# EAGLE schematic thermokipio (EAGLE 7.1.0)

## Sheet 1 of 2
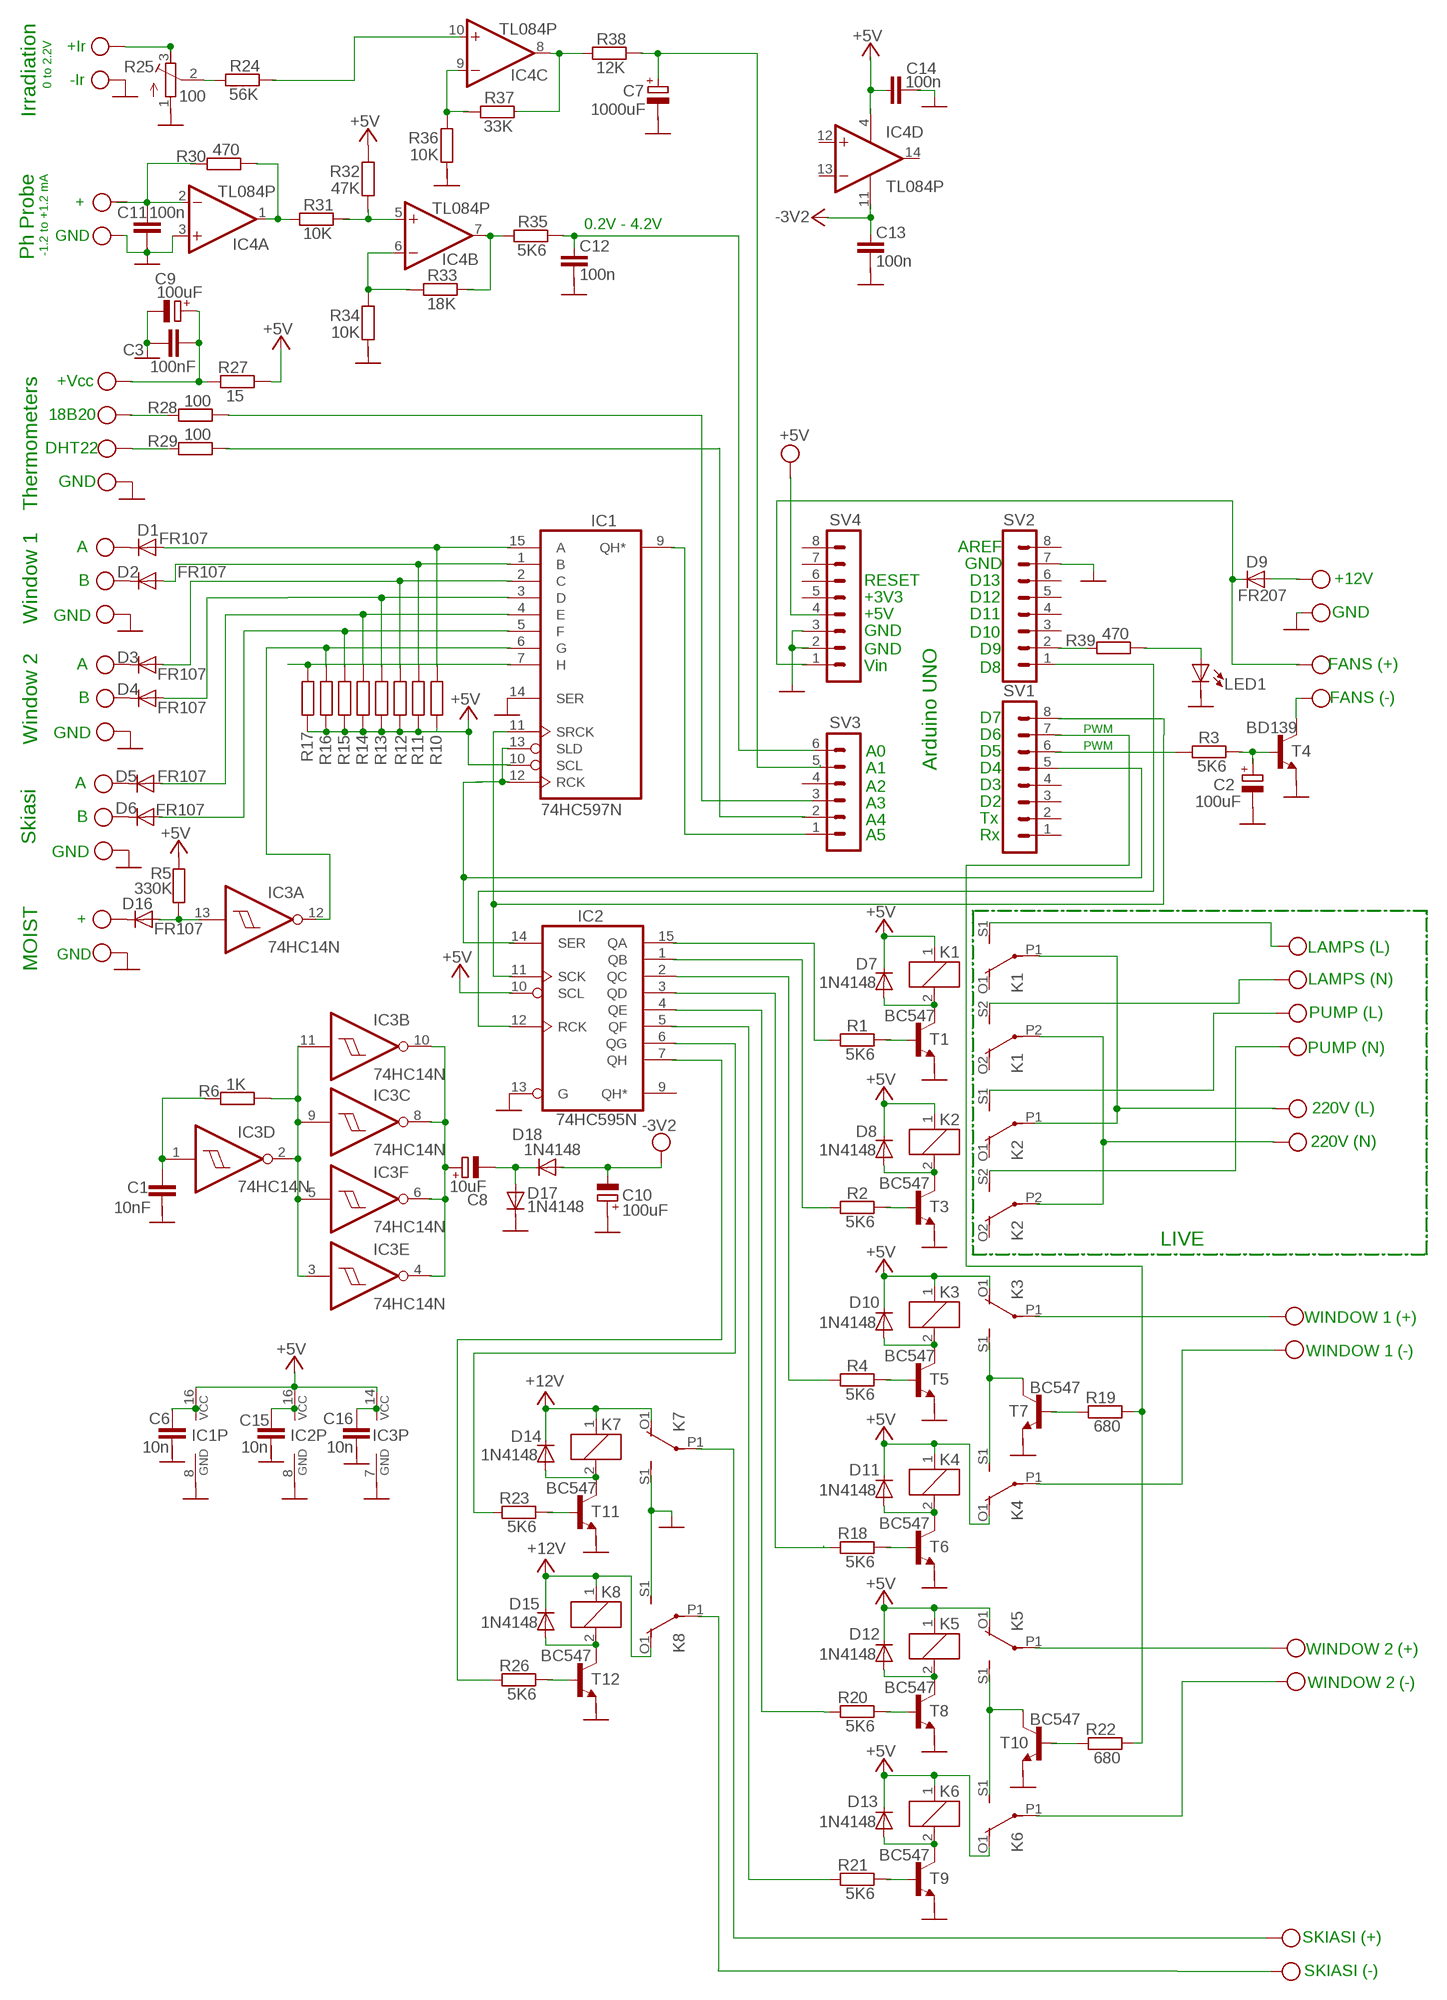
[diagram p0: schematic, sheet 1]

### Parts
A  W237-103  [W237-103]
A1  W237-103  [W237-103]
A2  W237-103  [W237-103]
C1  10nF  C5/2.5  [C5B2.5]
C2  100uF  CPOL-EUE2-5  [E2-5]
C3  100nF  C5/2.5  [C5B2.5]
C6  10n  C5/2.5  [C5B2.5]
C7  1000uF  CPOL-EUE2-5  [E2-5]
C8  10uF  CPOL-EUE2-5  [E2-5]
C9  100uF  CPOL-EUE2-5  [E2-5]
C10  100uF  CPOL-EUE2-5  [E2-5]
C11  100n  C5/2.5  [C5B2.5]
C12  100n  C5/2.5  [C5B2.5]
C13  100n  C5/2.5  [C5B2.5]
C14  100n  C5/2.5  [C5B2.5]
C15  10n  C5/2.5  [C5B2.5]
C16  10n  C5/2.5  [C5B2.5]
D1  FR107  1N4148DO35-7  [DO35-7]
D2  FR107  1N4148DO35-7  [DO35-7]
D3  FR107  1N4148DO35-7  [DO35-7]
D4  FR107  1N4148DO35-7  [DO35-7]
D5  FR107  1N4148DO35-7  [DO35-7]
D6  FR107  1N4148DO35-7  [DO35-7]
D7  1N4148  1N4148DO35-7  [DO35-7]
D8  1N4148  1N4148DO35-7  [DO35-7]
D9  FR207  1N4148DO35-7  [DO35-7]
D10  1N4148  1N4148DO35-7  [DO35-7]
D11  1N4148  1N4148DO35-7  [DO35-7]
D12  1N4148  1N4148DO35-7  [DO35-7]
D13  1N4148  1N4148DO35-7  [DO35-7]
D14  1N4148  1N4148DO35-7  [DO35-7]
D15  1N4148  1N4148DO35-7  [DO35-7]
D16  FR107  1N4148DO35-7  [DO35-7]
D17  1N4148  1N4148DO35-7  [DO35-7]
D18  1N4148  1N4148DO35-7  [DO35-7]
DHT  +3V3  W237-4  [W237-4]
DHT1  +3V3  W237-4  [W237-4]
IC1  74HC597N  [DIL16]
IC2  74HC595N  [DIL16]
IC3  74HC14N  [DIL14]
IC4  TL084P  [DIL14]
K1  4052  [F4052]
K2  4052  [F4052]
K3  4052  [F4052]
K4  4052  [F4052]
K5  4052  [F4052]
K6  4052  [F4052]
K7  4052  [F4052]
K8  4052  [F4052]
LED1  LEDCHIP-LED0603  [CHIP-LED0603]
R1  5K6  R0204/7  [0204/7]
R2  5K6  R0204/7  [0204/7]
R3  5K6  R0204/7  [0204/7]
R4  5K6  R0204/7  [0204/7]
R5  330K  R0204/7  [0204/7]
R6  1K  R0204/7  [0204/7]
R10  R0204/7  [0204/7]
R11  R0204/7  [0204/7]
R12  R0204/7  [0204/7]
R13  R0204/7  [0204/7]
R14  R0204/7  [0204/7]
R15  R0204/7  [0204/7]
R16  R0204/7  [0204/7]
R17  R0204/7  [0204/7]
R18  5K6  R0204/7  [0204/7]
R19  680  R0204/7  [0204/7]
R20  5K6  R0204/7  [0204/7]
R21  5K6  R0204/7  [0204/7]
R22  680  R0204/7  [0204/7]
R23  5K6  R0204/7  [0204/7]
R24  56K  R0204/7  [0204/7]
R25  100  R-TRIMM64Z  [RTRIM64Z]
R26  5K6  R0204/7  [0204/7]
R27  15  R0204/7  [0204/7]
R28  100  R0204/7  [0204/7]
R29  100  R0204/7  [0204/7]
R30  470  R0204/7  [0204/7]
R31  10K  R0204/7  [0204/7]
R32  47K  R0204/7  [0204/7]
R33  18K  R0204/7  [0204/7]
R34  10K  R0204/7  [0204/7]
R35  5K6  R0204/7  [0204/7]
R36  10K  R0204/7  [0204/7]
R37  33K  R0204/7  [0204/7]
R38  12K  R0204/7  [0204/7]
R39  470  R0204/7  [0204/7]
SV1  MA08-1  [MA08-1]
SV2  MA08-1  [MA08-1]
SV3  MA06-1  [MA06-1]
SV4  MA08-1  [MA08-1]
T1  BC547  [TO92]
T3  BC547  [TO92]
T4  BD139  BC547  [TO92]
T5  BC547  [TO92]
T6  BC547  [TO92]
T7  BC547  [TO92]
T8  BC547  [TO92]
T9  BC547  [TO92]
T10  BC547  [TO92]
T11  BC547  [TO92]
T12  BC547  [TO92]
X2  W237-102  [W237-102]
X3  W237-103  [W237-103]
X4  W237-103  [W237-103]
X5  W237-103  [W237-103]
X6  W237-103  [W237-103]
X7  W237-103  [W237-103]
X8  W237-103  [W237-103]
X9  W237-102  [W237-102]
X10  W237-102  [W237-102]

### Nets
GND: A1.3 A2.3 A.3 C3.1 C9.- DHT.4 IC1.14(SER) IC2.13(G) X2.2 X5.2 X10.2 ; also sheet 2
N$1: D16.C X2.1
N$2: IC3.13(A:I) R5.2
N$3: IC1.10(SCL) R10.1 R11.1 R12.1 R13.1 R14.1 R15.1 R16.1 R17.1
N$4: A.1 D1.C
N$5: A.2 D2.C
N$6: D4.A IC1.3(D)
N$8: D7.A
N$9: IC2.15(QA)
N$10: D3.A
N$12: IC3.3(E:I) IC3.5(F:I) IC3.9(C:I) R6.1
N$13: IC1.2(C)
N$15: IC1.11(SRCK) IC2.11(SCK)
N$17: R25.3(E) X10.1
N$20: D6.A IC1.5(F)
N$21: IC1.6(G) IC3.12(A:O)
N$22: IC2.12(RCK)
N$24: IC2.14(SER)
N$26: IC3.1(D:I)
N$27: D1.A IC1.15(A)
N$28: C8.+ IC3.10(B:O)
N$29: A1.1 D3.C
N$30: A1.2 D4.C
N$31: R3.2
N$32: A2.1 D5.C
N$33: R36.1
N$34: IC4.8(C:OUT)
N$35: IC1.9(QH*)
N$36: A2.2 D6.C
N$37: D2.A D5.A IC1.1(B) IC1.4(E) IC1.7(H) R10.2 R11.2 R12.2 R13.2 R14.2 R15.2 R16.2 R17.2
N$39: IC2.10(SCL)
N$40: T1.2(B)
N$41: K1.S1(2:S)
N$42: K1.S2(3:S)
N$43: D8.A
N$44: T3.2(B)
N$45: K2.S1(2:S)
N$46: K2.S2(3:S)
N$47: IC2.1(QB)
N$49: IC1.12(RCK) IC1.13(SLD)
N$50: K1.P2(3:P)
N$51: T4.3(C) X4.2
N$52: D9.A
N$53: D9.C
N$55: D10.A
N$56: IC2.2(QC)
N$57: T5.2(B)
N$59: X6.3
N$60: D11.A
N$61: T6.2(B)
N$66: R22.1
N$67: D12.A
N$68: IC2.4(QE) R20.2
N$69: R20.1 T8.2(B)
N$70: D13.A
N$71: R21.1 T9.2(B)
N$72: IC2.5(QF) R21.2
N$73: K5.P1(2:P) X7.3
N$74: K6.P1(2:P) X7.2
N$75: K5.S1(2:S) K6.S1(2:S) T10.3(C)
N$76: R22.2 T10.2(B)
N$78: IC2.3(QD)
N$79: D14.A
N$80: R23.2
N$81: R23.1 T11.2(B)
N$82: D15.A
N$83: R26.1 T12.2(B)
N$84: IC2.7(QH) R26.2
N$85: K7.P1(2:P) X8.3
N$86: C3.2 C9.+
N$87: K7.S1(2:S) K8.S1(2:S)
N$88: IC2.6(QG)
N$89: R28.2
N$90: R27.1
N$91: K8.P1(2:P) X8.2
N$92: DHT.3 R29.2
N$95: C8.- D17.A
N$96: C10.- ; supply symbol labelled -3V2
N$97: C11.2
N$99: C11.1 IC4.3(A:+IN) X9.2
N$101: R34.1
N$103: C12.2
N$104: R24.2 R25.2(S)
N$110: LED1.A
N$111: C14.1
N$112: C13.2 IC4.11(P:V-) ; supply symbol labelled -3V2
N$113: C14.2 IC4.4(P:V+) ; supply symbol labelled +5V
N$114: C6.2
N$115: C15.2
N$116: C16.2
N$117: IC1.16(VCC) IC2.16(VCC)
VCC: D10.C D11.C D12.C D13.C D14.C D15.C K1.1 K2.1 K3.1 K4.1 K5.1 K5.O1(2:O) K6.1 K6.O1(2:O) K7.1 K7.O1(2:O) K8.1 K8.O1(2:O) R32.1 ; supply symbol labelled +5V, +12V ; also sheet 2
Unconnected: C1.1 C1.2 C2.+ C2.- C6.1 C7.+ C7.- C10.+ C12.1 C13.1 C15.1 C16.1 D7.C D8.C D16.A D17.C D18.A D18.C DHT1.1 DHT1.2 DHT1.3 DHT1.4 DHT.1 DHT.2 IC2.9(QH*) IC3.2(D:O) IC3.4(E:O) IC3.6(F:O) IC3.8(C:O) IC3.11(B:I) IC4.1(A:OUT) IC4.2(A:-IN) IC4.5(B:+IN) IC4.6(B:-IN) IC4.7(B:OUT) IC4.9(C:-IN) IC4.10(C:+IN) IC4.12(D:+IN) IC4.13(D:-IN) IC4.14(D:OUT) K1.2 K1.O1(2:O) K1.O2(3:O) K1.P1(2:P) K2.2 K2.O1(2:O) K2.O2(3:O) K2.P1(2:P) K2.P2(3:P) K3.2 K3.O1(2:O) K3.O2(3:O) K3.P1(2:P) K3.P2(3:P) K3.S1(2:S) K3.S2(3:S) K4.2 K4.O1(2:O) K4.O2(3:O) K4.P1(2:P) K4.P2(3:P) K4.S1(2:S) K4.S2(3:S) K5.2 K5.O2(3:O) K5.P2(3:P) K5.S2(3:S) K6.2 K6.O2(3:O) K6.P2(3:P) K6.S2(3:S) K7.2 K7.O2(3:O) K7.P2(3:P) K7.S2(3:S) K8.2 K8.O2(3:O) K8.P2(3:P) K8.S2(3:S) LED1.C R1.1 R1.2 R2.1 R2.2 R3.1 R4.1 R4.2 R5.1 R6.2 R18.1 R18.2 R19.1 R19.2 R24.1 R25.1(A) R27.2 R28.1 R29.1 R30.1 R30.2 R31.1 R31.2 R32.2 R33.1 R33.2 R34.2 R35.1 R35.2 R36.2 R37.1 R37.2 R38.1 R38.2 R39.1 R39.2 SV1.1 SV1.2 SV1.3 SV1.4 SV1.5 SV1.6 SV1.7 SV1.8 SV2.1 SV2.2 SV2.3 SV2.4 SV2.5 SV2.6 SV2.7 SV2.8 SV3.1 SV3.2 SV3.3 SV3.4 SV3.5 SV3.6 SV4.1 SV4.2 SV4.3 SV4.4 SV4.5 SV4.6 SV4.7 SV4.8 T1.1(E) T1.3(C) T3.1(E) T3.3(C) T4.1(E) T4.2(B) T5.1(E) T5.3(C) T6.1(E) T6.3(C) T7.1(E) T7.2(B) T7.3(C) T8.1(E) T8.3(C) T9.1(E) T9.3(C) T10.1(E) T11.1(E) T11.3(C) T12.1(E) T12.3(C) X3.1 X3.2 X3.3 X4.1 X4.3 X5.1 X5.3 X6.1 X6.2 X7.1 X8.1 X9.1

### Notes on the sheet
- Irradiation
- +Ir
- -Ir
- 0 to 2.2V
- Ph Probe
- +
- 0.2V - 4.2V
- GND
- -1.2 to +1.2 mA
- Thermometers
- +Vcc
- 18B20
- DHT22
- GND
- Window 1
- A | AREF
- GND
- B | RESET | D13 | +12V
- +3V3 | D12
- GND | +5V | D11 | GND
- GND | D10
- Window 2 | Arduino UNO
- GND | D9
- A | Vin | D8 | FANS (+)
- B | FANS (-)
- D7
- PWM
- GND | D6
- PWM
- A0 | D5
- A1 | D4
- Skiasi | A | A2 | D3
- A3 | D2
- B | A4 | Tx
- A5 | Rx
- GND
- MOIST
- +
- LAMPS (L)
- GND
- LAMPS (N)
- PUMP (L)
- PUMP (N)
- 220V (L)
- 220V (N)
- LIVE
- WINDOW 1 (+)
- WINDOW 1 (-)
- WINDOW 2 (+)
- WINDOW 2 (-)
- SKIASI (+)
- SKIASI (-)

## Sheet 2 of 2
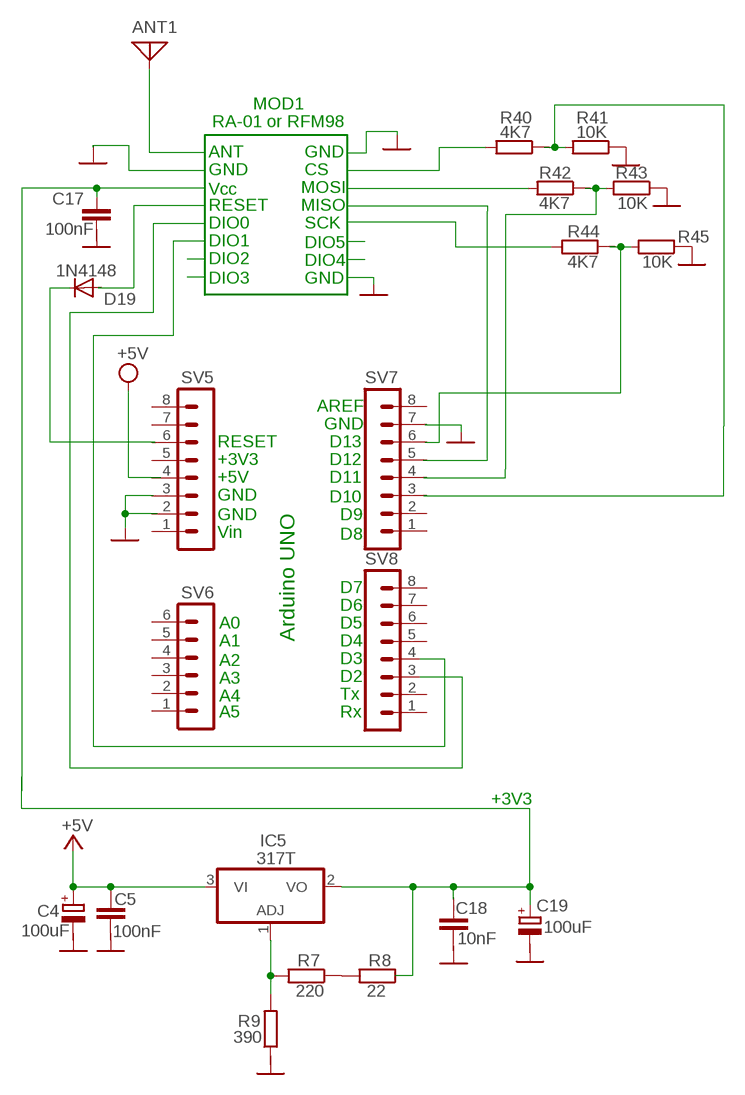
[diagram p1: schematic, sheet 2]

### Parts
ANT1  ANTENNA  [PAD-01]
C4  100uF  CPOL-EUE2-5  [E2-5]
C5  100nF  C5/2.5  [C5B2.5]
C17  100nF  C5/2.5  [C5B2.5]
C18  10nF  C5/2.5  [C5B2.5]
C19  100uF  CPOL-EUE2-5  [E2-5]
D19  1N4148  1N4148DO35-7  [DO35-7]
IC5  317T  [TO220H]
R7  220  R0204/7  [0204/7]
R8  22  R0204/7  [0204/7]
R9  390  R0204/7  [0204/7]
R40  4K7  R0204/7  [0204/7]
R41  10K  R0204/7  [0204/7]
R42  4K7  R0204/7  [0204/7]
R43  10K  R0204/7  [0204/7]
R44  4K7  R0204/7  [0204/7]
R45  10K  R0204/7  [0204/7]
SV5  MA08-1  [MA08-1]
SV6  MA06-1  [MA06-1]
SV7  MA08-1  [MA08-1]
SV8  MA08-1  [MA08-1]

### Nets
GND: C17.1 D19.A R41.1 R43.1 R44.2 R45.1 ; also sheet 1
N$7: D19.C
N$16: R7.1 R8.2
N$19: IC5.1(ADJ) R7.2 R9.2
N$23: C18.1 C19.+ IC5.2(VO) R8.1
N$118: R40.2
N$125: R40.1 R41.2
N$126: R42.2
N$127: R42.1 R43.2
N$129: R44.1 R45.2
VCC: C4.+ C5.1 IC5.3(VI) ; supply symbol labelled +5V ; also sheet 1
Unconnected: ANT1.1 C4.- C5.2 C17.2 C18.2 C19.- R9.1 SV5.1 SV5.2 SV5.3 SV5.4 SV5.5 SV5.6 SV5.7 SV5.8 SV6.1 SV6.2 SV6.3 SV6.4 SV6.5 SV6.6 SV7.1 SV7.2 SV7.3 SV7.4 SV7.5 SV7.6 SV7.7 SV7.8 SV8.1 SV8.2 SV8.3 SV8.4 SV8.5 SV8.6 SV8.7 SV8.8

### Notes on the sheet
- MOD1
- RA-01 or RFM98
- ANT | GND
- GND | CS
- Vcc | MOSI
- RESET | MISO
- DIO0 | SCK
- DIO1 | DIO5
- DIO2 | DIO4
- DIO3 | GND
- AREF
- GND
- RESET | D13
- +3V3 | D12
- +5V | D11
- GND | D10
- Arduino UNO
- GND | D9
- Vin | D8
- D7
- D6
- A0 | D5
- A1 | D4
- A2 | D3
- A3 | D2
- A4 | Tx
- A5 | Rx
- +3V3

## Power pins joined to a net without a drawn wire
GND: IC1.8(GND) IC2.8(GND) IC3.7(P:GND)
VCC: IC3.14(P:VCC)

## Library data of the parts
A A1 A2 X3-X8 = con-wago-500:W237-103: WAGO SCREW CLAMP; MPN: 237-103; OC_FARNELL: unknown; OC_NEWARK: 18M7116
ANT1 = discrete:ANTENNA: Antenna
C1 C3 C5 C6 C11-C18 = capacitor-wima:C: CAPACITOR naming: grid - package width
C2 C4 C7-C10 C19 = rcl:CPOL-EU: POLARIZED CAPACITOR, European symbol
D1-D19 = diode:1N4148: DIODE high speed (Philips)
DHT DHT1 = con-wago-500:W237-4: WAGO SCREW CLAMP; OC_FARNELL: unknown; OC_NEWARK: unknown
IC1 = 74xx-eu:74*597: 8-bit SHIFT REGISTER, input latch
IC2 = 74xx-eu:74*595: 8-bit SHIFT REGISTER, output latch
IC3 = 74xx-eu:74*14: Hex schmitt trigger INVERTER
IC4 = linear:TL084: OP AMP
IC5 = linear:*317: Positive VOLTAGE REGULATOR
K1-K8 = relay:4052: RELAY 2 x switch, Finder; OC_FARNELL: unknown; OC_NEWARK: unknown
LED1 = led:LED: LED OSRAM: - CHIPLED LG R971, LG N971, LY N971, LG Q971, LY Q971, LO R971, LY R971 LH N974, LH R974 LS Q976, LO Q976, LY Q976 LO Q996 - Hyper CHIPLED LW Q18S LB Q993, LB Q99A, LB R99A - SideLED LS A670, LO A670, LY A670, LG A670, LP A670 LB A673, LV A673, LT A673, LW A673 LH A674 LY A675 LS A676, LA A676, LO A676, LY A676, LW A676 LS A679, LY A679, LG A679 - Hyper Micro SIDELED® LS Y876, LA Y876, LO Y876, LY Y876 LT Y87S - SmartLED LW L88C, LW L88S LB L89C, LB L89S, LG L890 LS L89K, LO L89K, LY L89K LS L896, LA L896, LO L896, LY L896 - TOPLED LS T670, LO T670, LY T670, LG T670, LP T670 LSG T670, LSP T670, LSY T670, LOP T670, LYG T670 LG T671, LOG T671, LSG T671 LB T673, LV T673, LT T673, LW T673 LH T674 LS T676, LA T676, LO T676, LY T676, LB T676, LH T676, LSB T676, LW T676 LB T67C, LV T67C, LT T67C, LS T67K, LO T67K, LY T67K, LW E67C LS E67B, LA E67B, LO E67B, LY E67B, LB E67C, LV E67C, LT E67C LW T67C LS T679, LY T679, LG T679 LS T770, LO T770, LY T770, LG T770, LP T770 LB T773, LV T773, LT T773, LW T773 LH T774 LS E675, LA E675, LY E675, LS T675 LS T776, LA T776, LO T776, LY T776, LB T776 LHGB T686 LT T68C, LB T68C - Hyper Mini TOPLED® LB M676 - Mini TOPLED Santana® LG M470 LS M47K, LO M47K, LY M47K Source: http://www.osram.convergy.de LUXEON: - LUMILED® LXK2-PW12-R00, LXK2-PW12-S00, LXK2-PW14-U00, LXK2-PW14-V00 LXK2-PM12-R00, LXK2-PM12-S00, LXK2-PM14-U00 LXK2-PE12-Q00, LXK2-PE12-R00, LXK2-PE12-S00, LXK2-PE14-T00, LXK2-PE14-U00 LXK2-PB12-K00, LXK2-PB12-L00, LXK2-PB12-M00, LXK2-PB14-N00, LXK2-PB14-P00, LXK2-PB14-Q00 LXK2-PR12-L00, LXK2-PR12-M00, LXK2-PR14-Q00, LXK2-PR14-R00 LXK2-PD12-Q00, LXK2-PD12-R00, LXK2-PD12-S00 LXK2-PH12-R00, LXK2-PH12-S00 LXK2-PL12-P00, LXK2-PL12-Q00, LXK2-PL12-R00 Source: www.luxeon.com KINGBRIGHT: KA-3528ASYC Source: www.kingbright.com
R1-R24 R26-R45 = eagle-ltspice:R: RESISTOR, European symbol; SPICEMODEL: NONE; SPICEPREFIX: R
R25 = rcl:R-TRIMM: Trimm resistor
SV1 SV2 SV4 SV5 SV7 SV8 = con-lstb:MA08-1: PIN HEADER; OC_FARNELL: unknown; OC_NEWARK: unknown
SV3 SV6 = con-lstb:MA06-1: PIN HEADER; OC_FARNELL: unknown; OC_NEWARK: unknown
T1 T3-T12 = transistor:BC547: NPN TRANSISTOR
X2 X9 X10 = con-wago-500:W237-102: WAGO SCREW CLAMP; MPN: 237-102; OC_FARNELL: unknown; OC_NEWARK: 70K9898